# EAGLE design KaiShield (EAGLE 7.2.0)
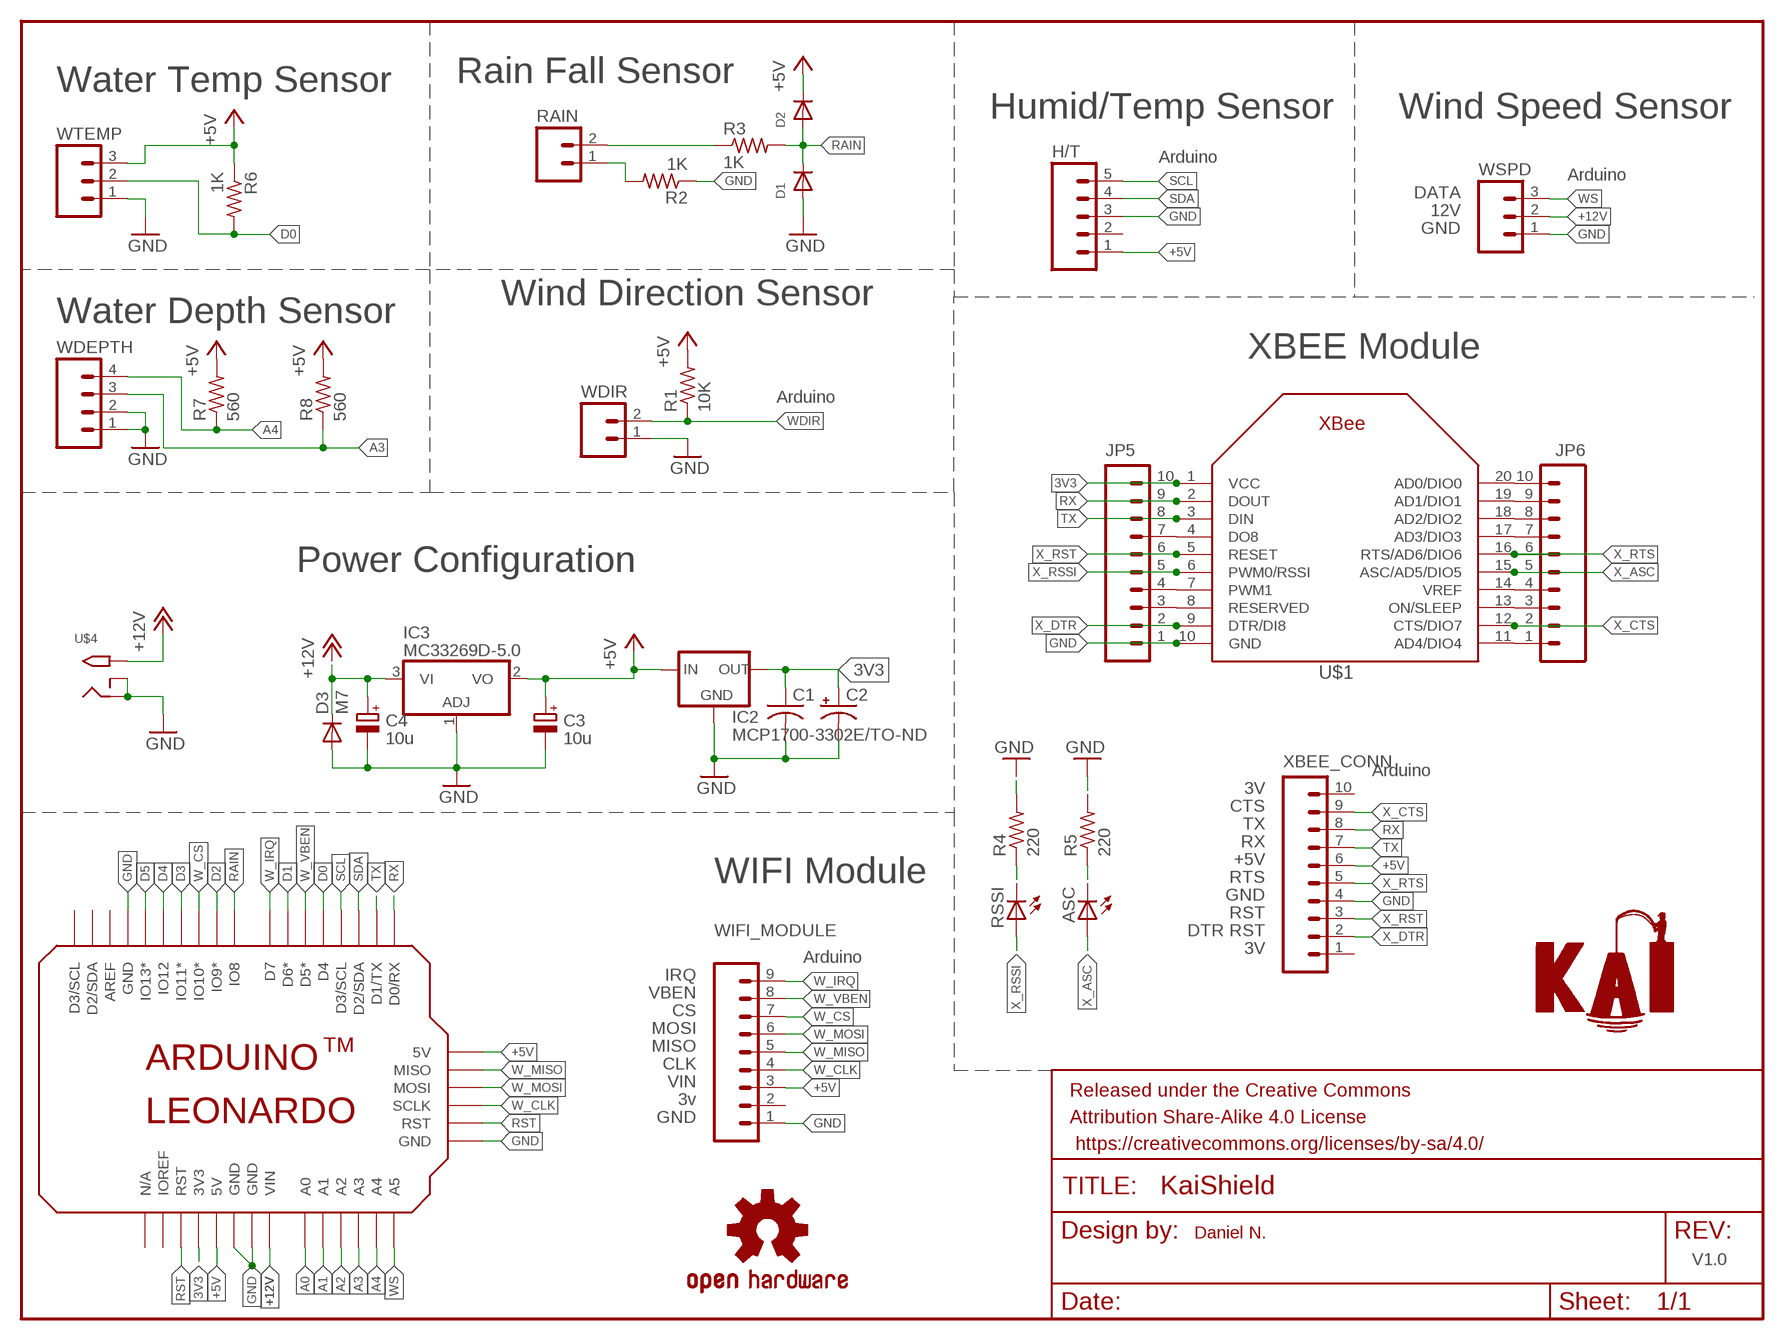
[diagram p0: schematic, sheet 1]

## Parts
ASC  LED3MM  [LED3MM]
C1  C-US025-025X050  [C025-025X050]
C2  CPOL-USE2.5-5  [E2,5-5]
C3  10u  CPOL-EUSMCB  [SMC_B]
C4  10u  CPOL-EUSMCB  [SMC_B]
D1  DIODEDO-1N4148  [DO-1N4148]
D2  DIODEDO-1N4148  [DO-1N4148]
D3  M7  DIODE-SMB  [SMB]
FRAME1  FRAME-LETTERNO_PACKAGE  [DUMMY]
H/T  M05PTH  [1X05]
IC2  MCP1700-3302E/TO-ND  MCP1700TRI  [TO92]
IC3  MC33269D-5.0  [DPACK]
JP5  M10SILK_FEMALE_PTH  [1X10]
JP6  M10SILK_FEMALE_PTH  [1X10]
LOGO1  OSHW-LOGOM  [OSHW-LOGO-M]
R1  10K  R-US_0207/10  [0207/10]
R2  1K  R-US_0207/10  [0207/10]
R3  1K  R-US_0207/10  [0207/10]
R4  220  R-US_0207/10  [0207/10]
R5  220  R-US_0207/10  [0207/10]
R6  1K  R-US_0207/10  [0207/10]
R7  560  R-US_0207/10  [0207/10]
R8  560  R-US_0207/10  [0207/10]
RAIN  M02PTH  [1X02]
RSSI  LED3MM  [LED3MM]
U$1  XBEE  [XBEE]
U$2  LEONARDO  [LEONARDO]
U$3  KAI_LOGO  [KAI_LOGO]
U$4  2.1MMJACKTHM  [PJ-102A]
WDEPTH  M04PTH  [1X04]
WDIR  M02PTH  [1X02]
WIFI_MODULE  M09  [1X09]
WSPD  M03PTH  [1X03]
WTEMP  M03PTH  [1X03]
XBEE_CONN  M10SILK_FEMALE_PTH  [1X10]

## Nets
3V3: C1.1 C2.+ IC2.3(OUT) JP5.10 U$1.1(VCC) U$2.3V(3V3)
+5V [power]: C3.+ D2.C H/T.1 IC2.2(IN) IC3.2(VO) R1.2 R6.1 R7.2 R8.2 U$2.5V U$2.5V@1(5V) WIFI_MODULE.3 WTEMP.3 XBEE_CONN.6
+12V [VIN]: C4.+ D3.C IC3.3(VI) U$2.VIN U$4.TIP WSPD.2
A0: U$2.A0
A1: U$2.A1
A2: U$2.A2
A3: R8.1 U$2.A3 WDEPTH.3
A4: R7.1 U$2.A4 WDEPTH.4
D0: R6.2 U$2.D4 WTEMP.2
D1: U$2.D6(D6*)
D2: U$2.D9(IO9*)
D3: U$2.D11(IO11*)
D4: U$2.D12(IO12)
D5: U$2.D13(IO13*)
GND [GND]: C1.2 C2.- C3.- C4.- D1.A D3.A H/T.3 IC2.1(GND) IC3.1(ADJ) JP5.1 R2.1 R4.2 R5.2 U$1.10(GND) U$2.GND U$2.GND1(GND) U$2.GND2(GND) U$2.GND3(GND) U$4.RING U$4.RING_SW WDEPTH.1 WDEPTH.2 WDIR.1 WIFI_MODULE.1 WSPD.1 WTEMP.1 XBEE_CONN.4
N$1: R3.1 RAIN.2
N$2: JP6.4 U$1.14(VREF)
N$3: R2.2 RAIN.1
N$4: JP6.3 U$1.13(ON/SLEEP)
N$5: R4.1 RSSI.K(C)
N$6: ASC.K(C) R5.1
N$7: JP5.7 U$1.4(DO8)
N$8: JP5.4 U$1.7(PWM1)
N$9: JP5.3 U$1.8(RESERVED)
RAIN: D1.C D2.A R3.2 U$2.D8(IO8)
RST: U$2.RST U$2.RST.(RST)
RX: JP5.9 U$1.2(DOUT) U$2.D0(D0/RX) XBEE_CONN.8
SCL: H/T.5 U$2.D3SCL(D3/SCL)
SDA: H/T.4 U$2.D2SDA(D2/SDA)
TX: JP5.8 U$1.3(DIN) U$2.D1(D1/TX) XBEE_CONN.7
W_CLK: U$2.SCLK WIFI_MODULE.4
W_CS: U$2.D10(IO10*) WIFI_MODULE.7
W_IRQ: U$2.D7 WIFI_MODULE.9
W_MISO: U$2.MISO WIFI_MODULE.5
W_MOSI: U$2.MOSI WIFI_MODULE.6
W_VBEN: U$2.D5(D5*) WIFI_MODULE.8
WDIR: R1.1 WDIR.2
WS: U$2.A5 WSPD.3
X0: JP6.10 U$1.20(AD0/DIO0)
X1: JP6.9 U$1.19(AD1/DIO1)
X2: JP6.8 U$1.18(AD2/DIO2)
X3: JP6.7 U$1.17(AD3/DIO3)
X4: JP6.1 U$1.11(AD4/DIO4)
X_ASC: ASC.A JP6.5 U$1.15(ASC/AD5/DIO5)
X_CTS: JP6.2 U$1.12(CTS/DIO7) XBEE_CONN.9
X_DTR: JP5.2 U$1.9(DTR/DI8) XBEE_CONN.2
X_RSSI: JP5.5 RSSI.A U$1.6(PWM0/RSSI)
X_RST: JP5.6 U$1.5(RESET) XBEE_CONN.3
X_RTS: JP6.6 U$1.16(RTS/AD6/DIO6) XBEE_CONN.5
Unconnected: H/T.2 U$2.AREF U$2.D2SDA1(D2/SDA) U$2.D3SCL1(D3/SCL) U$2.I/OREF(IOREF) U$2.NA(N/A) WIFI_MODULE.2 XBEE_CONN.1 XBEE_CONN.10

## Notes on the sheet
- Water Temp Sensor | Rain Fall Sensor
- Humid/Temp Sensor | Wind Speed Sensor
- Arduino
- Arduino
- DATA
- 12V
- GND
- Wind Direction Sensor
- Water Depth Sensor
- XBEE Module
- Arduino
- Power Configuration
- Arduino
- 3V
- CTS
- TX
- RX
- +5V
- WIFI Module | RTS
- GND
- RST
- DTR RST
- 3V
- Arduino
- IRQ
- VBEN
- CS
- MOSI
- MISO
- CLK
- VIN
- 3v
- GND
- Daniel N.
- V1.0

## Library data of the parts
ASC RSSI = adafruit:LED: LED OSRAM: - CHIPLED LG R971, LG N971, LY N971, LG Q971, LY Q971, LO R971, LY R971 LH N974, LH R974 LS Q976, LO Q976, LY Q976 LO Q996 - Hyper CHIPLED LW Q18S LB Q993, LB Q99A, LB R99A - SideLED LS A670, LO A670, LY A670, LG A670, LP A670 LB A673, LV A673, LT A673, LW A673 LH A674 LY A675 LS A676, LA A676, LO A676, LY A676, LW A676 LS A679, LY A679, LG A679 - Hyper Micro SIDELED® LS Y876, LA Y876, LO Y876, LY Y876 LT Y87S - SmartLED LW L88C, LW L88S LB L89C, LB L89S, LG L890 LS L89K, LO L89K, LY L89K LS L896, LA L896, LO L896, LY L896 - TOPLED LS T670, LO T670, LY T670, LG T670, LP T670 LSG T670, LSP T670, LSY T670, LOP T670, LYG T670 LG T671, LOG T671, LSG T671 LB T673, LV T673, LT T673, LW T673 LH T674 LS T676, LA T676, LO T676, LY T676, LB T676, LH T676, LSB T676, LW T676 LB T67C, LV T67C, LT T67C, LS T67K, LO T67K, LY T67K, LW E67C LS E67B, LA E67B, LO E67B, LY E67B, LB E67C, LV E67C, LT E67C LW T67C LS T679, LY T679, LG T679 LS T770, LO T770, LY T770, LG T770, LP T770 LB T773, LV T773, LT T773, LW T773 LH T774 LS E675, LA E675, LY E675, LS T675 LS T776, LA T776, LO T776, LY T776, LB T776 LHGB T686 LT T68C, LB T68C - Hyper Mini TOPLED® LB M676 - Mini TOPLED Santana® LG M470 LS M47K, LO M47K, LY M47K Source: http://www.osram.convergy.de/
C1 = rcl:C-US: CAPACITOR, American symbol
C2 = rcl:CPOL-US: POLARIZED CAPACITOR, American symbol
C3 C4 = rcl:CPOL-EU: POLARIZED CAPACITOR, European symbol
D1 D2 = adafruit:DIODE: Diode SMADIODE - SMA Surface Mount Package 20V 1A Schottky Diode Digikey: 641-1014-6-ND DO-1N4148 - Through Hole Small Current Diode SOD-123 20V 1 A (.5mV Vf) Schottky Diode - Digikey: MBRX120TPMSCT-ND SOD-323 10V 570mA (.38mV Vf, 3ns) Schottky Diode - Digikey: ZLLS410CT-ND SOD-523 30V 30mA Schottky Diode (RB751S-40TE61) - Digikey: RB751S-40TE61CT-ND SOT23-R/W - SOT23 Package (R = Solder Paste/Reflow Ovens, W = Hand-Soldering) BAT54Film 40V 300mA - Digikey: 497-7162-1-ND
D3 = diode:DIODE-: DIODE
FRAME1 = SparkFun-Aesthetics:FRAME-LETTER: Schematic Frame Standard 8.5x11 US Letter frame; DESIGNER: Nobody; VERSION: v01
H/T = SparkFun-Connectors:M05: Header 5 Standard 5-pin 0.1" header. Use with straight break away headers (SKU : PRT-00116), right angle break away headers (PRT-00553), swiss pins (PRT-00743), machine pins (PRT-00117), and female headers (PRT-00115). Molex polarized connector foot print use with SKU : PRT-08230 with associated crimp pins and housings.
IC2 = adafruit:MCP1700: VOLTAGE REGULATOR
IC3 = linear:MC33269?*: Adjustable Output Low Dropout Voltage Regulator 800 mA Source: http://www.onsemi.com/pub/Collateral/MC33269-D.PDF
JP5 JP6 XBEE_CONN = SparkFun-Connectors:M10: Header 10 Standard 10-pin 0.1" header. Use with straight break away headers (SKU : PRT-00116), right angle break away headers (PRT-00553), swiss pins (PRT-00743), machine pins (PRT-00117), and female headers (PRT-00115).; PROD_ID: CONN-11563
LOGO1 = SparkFun-Aesthetics:OSHW-LOGO: Open Source Hardware Logo This logo indicates the piece of hardware it is found on incorporates a OSHW license and/or adheres to the definition of open source hardware found here: http://freedomdefined.org/OSHW
R1-R8 = rcl:R-US_: RESISTOR, American symbol
RAIN WDIR = SparkFun-Connectors:M02: Standard 2-pin 0.1" header. Use with - straight break away headers ( PRT-00116) - right angle break away headers (PRT-00553) - swiss pins (PRT-00743) - machine pins (PRT-00117) - female headers (PRT-00115) Molex polarized connector foot print use with: PRT-08233 with associated crimp pins and housings. 2.54_SCREWTERM for use with PRT-10571. 3.5mm Screw Terminal footprints for PRT-08084 5mm Screw Terminal footprints for use with PRT-08432
U$1 = adafruit:XBEE
U$2 = Kai:LEONARDO: Leonardo Shield Leonardo Shield package. Contains all the pins for the Leonardo. The outline is on the DIMENSION layer. Originally Modified from Adafruit Arduino Package.
U$3 = Kai:KAI_LOGO
U$4 = adafruit:2.1MMJACK: 2.1mm x 5.5mm THM DC jack with internal switch. Digikey part #PJ-102A, 4UCON part #05537 2.1mm x 5.5mm SMT DC jack with internal switch. Digikey part #PJ-002A-SMT, 4UCON part #03267 By microbuilder.eu & adafruit.com
WDEPTH = SparkFun-Connectors:M04: Header 4 Standard 4-pin 0.1" header. Use with straight break away headers (SKU : PRT-00116), right angle break away headers (PRT-00553), swiss pins (PRT-00743), machine pins (PRT-00117), and female headers (PRT-00115). Molex polarized connector foot print use with SKU : PRT-08231 with associated crimp pins and housings. 1MM SMD Version SKU: PRT-10208
WIFI_MODULE = SparkFun-Connectors:M09: Header 9 Standard 9-pin 0.1" header. Use with straight break away headers (SKU : PRT-00116), right angle break away headers (PRT-00553), swiss pins (PRT-00743), machine pins (PRT-00117), and female headers (PRT-00115).
WSPD WTEMP = SparkFun-Connectors:M03: Header 3 Standard 3-pin 0.1" header. Use with straight break away headers (SKU : PRT-00116), right angle break away headers (PRT-00553), swiss pins (PRT-00743), machine pins (PRT-00117), and female headers (PRT-00115). Molex polarized connector foot print use with SKU : PRT-08232 with associated crimp pins and housings.

## Net classes
0 default: width 0.305 mm, drill 0.61 mm, clearance 0.254 mm
1 GND: width 0.305 mm, drill 0.61 mm, clearance 0.254 mm
2 power: width 0.61 mm, drill 0.61 mm, clearance 0.254 mm
3 VIN: width 0.61 mm, drill 0.61 mm, clearance 0.254 mm

## Board
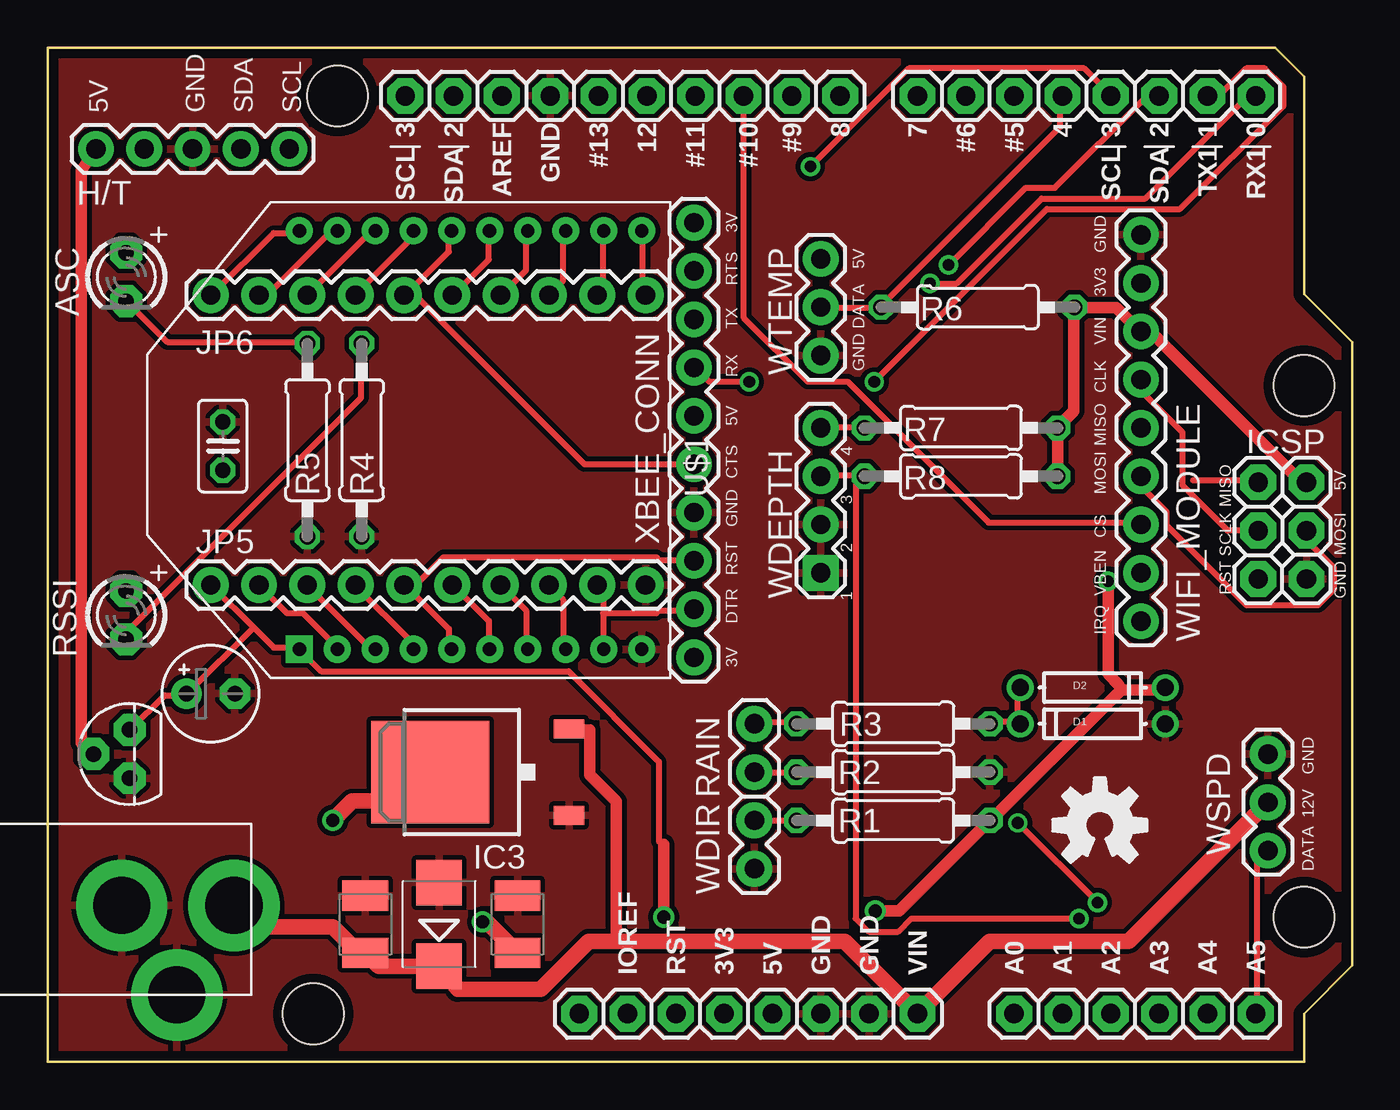
[diagram p1: board, top side]
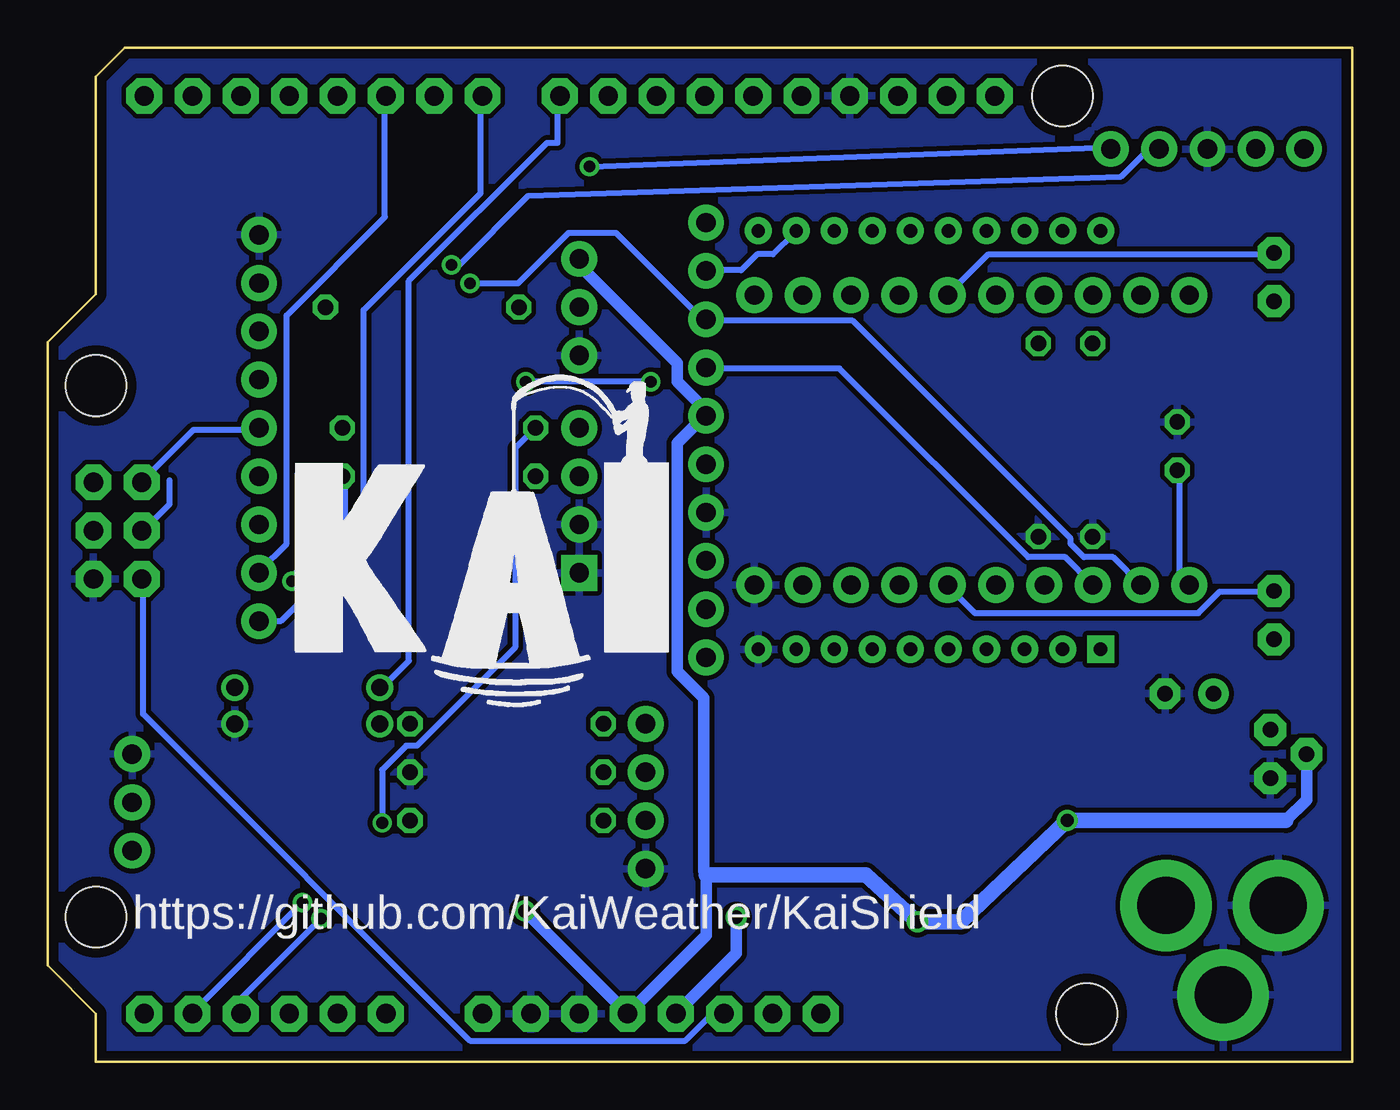
[diagram p2: board, bottom side, seen from below]

Size 68.58 x 53.34 mm. Coordinates in mm from the lower left corner, seen from the top.
Copper layers (1*16): Top 0.035mm / dielectric 1.5mm / Bottom 0.035mm
Design rules "default *": minimum track width 10mil, minimum drill 24mil, track to track 8mil, track to pad 8mil, pad to pad 8mil, via to via 8mil, smd to smd 8mil, copper to edge 20mil, drill to drill 8mil, minimum pad ring 10mil, minimum via ring 8mil, stop-mask expansion 4mil, vias tented up to drill 0mil, thermal gap 10mil

### Footprints (pad centres in the part's own frame; a part is rotated, then mirrored left to right if it is on the bottom)
LED3MM = drill 0.813 pad 1.676 octagon: A -1.27,0; K 1.27,0
C025-025X050 = drill 0.813 octagon: 1 -1.27,0; 2 1.27,0
E2,5-5 = drill 0.813 pad 1.6: + -1.27,0 | drill 0.813 pad 1.6 octagon: - 1.27,0
SMC_B = smd 1.6 x 2.4: + -1.5,0; - 1.5,0
DO-1N4148 = drill 0.9: A -3.81,0; C 3.81,0
SMB = smd 2.4 x 2.4: A 2.2,0; C -2.2,0
1X05 = drill 1.016 pad 1.88: 1 0,0; 2 2.54,0; 3 5.08,0; 4 7.62,0; 5 10.16,0
TO92 = drill 0.813 pad 1.676 octagon: 1 -1.27,0; 2 0,1.905; 3 1.27,0
DPACK = smd 1 x 1.6: 1 -2.28,-4.8; 3 2.28,-4.8 | smd 5.4 x 6.2: 2 0,2.5
1X10 = drill 1.016 pad 1.88: 1 0,0; 2 2.54,0; 3 5.08,0; 4 7.62,0; 5 10.16,0; 6 12.7,0; 7 15.24,0; 8 17.78,0; 9 20.32,0; 10 22.86,0
0207/10 = drill 0.813 octagon: 1 -5.08,0; 2 5.08,0
1X02 = drill 1.016 pad 1.88: 1 0,0; 2 2.54,0
XBEE = drill 0.7 pad 1.422 square: 1 -11,5.5 | drill 0.7 pad 1.422: 2 -11,3.5; 3 -11,1.5; 4 -11,-0.5; 5 -11,-2.5; 6 -11,-4.5; 7 -11,-6.5; 8 -11,-8.5; 9 -11,-10.5; 10 -11,-12.5; 11 11,-12.5; 12 11,-10.5; 13 11,-8.5; 14 11,-6.5; 15 11,-4.5; 16 11,-2.5; 17 11,-0.5; 18 11,1.5; 19 11,3.5; 20 11,5.5
LEONARDO = drill 1.016 pad 1.88 octagon: 3V 35.56,2.54; 5V 38.1,2.54; 5V@1 66.167,30.48; A0 50.8,2.54; A1 53.34,2.54; A2 55.88,2.54; A3 58.42,2.54; A4 60.96,2.54; A5 63.5,2.54; AREF 23.876,50.8; D0 63.5,50.8; D1 60.96,50.8; D2SDA 58.42,50.8; D2SDA1 21.336,50.8; D3SCL 55.88,50.8; D3SCL1 18.796,50.8; D4 53.34,50.8; D5 50.8,50.8; D6 48.26,50.8; D7 45.72,50.8; D8 41.656,50.8; D9 39.116,50.8; D10 36.576,50.8; D11 34.036,50.8; D12 31.496,50.8; D13 28.956,50.8; GND 26.416,50.8; GND1 43.18,2.54; GND2 40.64,2.54; GND3 66.167,25.4; I/OREF 30.48,2.54; MISO 63.627,30.48; MOSI 66.167,27.94; NA 27.94,2.54; RST 33.02,2.54; RST. 63.627,25.4; SCLK 63.627,27.94; VIN 45.72,2.54 | hole 3.2: 15.24,50.8; 66.04,35.56; 13.97,2.54; 66.04,7.62
PJ-102A = drill 3 pad 4.8: RING 0.1,-3.39; RING_SW -4.6,-6.29; TIP 0.1,-9.29
1X04 = drill 1.016 pad 1.88 square: 1 0,0 | drill 1.016 pad 1.88: 2 2.54,0; 3 5.08,0; 4 7.62,0
1X09 = drill 1.016 pad 1.88: 1 0,0; 2 2.54,0; 3 5.08,0; 4 7.62,0; 5 10.16,0; 6 12.7,0; 7 15.24,0; 8 17.78,0; 9 20.32,0
1X03 = drill 1.016 pad 1.88: 1 0,0; 2 2.54,0; 3 5.08,0

### Placement (x,y rotation side)
ASC  4.13,41.27 270 top
C1  9.21,32.38 90 top
C2  8.57,19.37 0 top
C3  24.7,7.24 90 top
C4  16.7,7.24 90 top
D1  54.93,17.78 180 top
D2  54.93,19.68 0 top
D3  20.57,7.24 90 top
FRAME1  0,0.32 0 top
H/T  2.54,48.01 0 top
IC2  4.32,16.19 90 top
IC3  22.61,15.24 90 top
JP5  31.43,25.08 180 top
JP6  31.43,40.32 180 top
LOGO1  55.31,12.45 0 top
R1  44.45,12.7 0 top
R2  44.45,15.24 180 top
R3  44.45,17.78 0 top
R4  16.51,32.7 270 top
R5  13.65,32.7 270 top
R6  48.9,39.69 180 top
R7  48.01,33.34 0 top
R8  48.01,30.8 0 top
RAIN  37.15,15.24 90 top
RSSI  4.13,23.5 270 top
U$1  18.73,32.7 90 top
U$2  0,0 0 top
U$3  58.74,18.35 0 bottom
U$4  0.51,8.13 90 top
WDEPTH  40.64,25.72 90 top
WDIR  37.15,10.16 90 top
WIFI_MODULE  57.47,43.5 270 top
WSPD  64.14,16.19 270 top
WTEMP  40.64,37.15 90 top
XBEE_CONN  33.97,21.27 90 top

### Tracks (layer width: path | path; a pad name or v marks a point on that pad's centre or on a via)
3V3  (via drill 0.7)
  Top 0.305: IC2.3 4.33,17.46 6.15,19.28 7.26,19.28 C2.+ 7.4,19.42 10.83,22.84 | 10.83,22.84 8.66,25.01 JP5.10 | 10.83,22.84 11.87,21.79 13.13,21.79 U$1.1 13.27,21.65 14.39,20.54 27.38,20.54 32.13,15.79 32.13,11.6 32.38,11.43
  Top 0.61: 32.38,11.43 v32.38,7.62
  Bottom 0.305: C1.1 9.08,31.01 9.08,25.57 8.66,25.15 JP5.10
  Bottom 0.61: v32.38,7.62 32.38,5.71 U$2.3V
+5V  (via drill 0.61, 0.7)
  Top 0.61: IC2.2 2.35,16.19 1.78,16.76 1.78,46.86 H/T.1 | v43.5,7.94 44.77,7.94 R1.2 49.73,12.85 56.44,19.56 | 65.66,30.59 66.08,30.59 U$2.5V@1 65.52,30.87 58.12,38.28 57.7,38.28 WIFI_MODULE.3 57.42,38.42 56.16,39.67 54.06,39.67 R6.1 53.92,39.4 53.92,34.23 53.23,33.53 R7.2 R8.2 | 56.44,19.56 58.67,19.56 D2.C | v55.74,25.29 55.74,20.4 56.3,19.84 56.44,19.56
  Top 0.813: v22.86,7.37 23.07,7.37 C3.+ | v14.99,12.7 16,13.72 19.6,13.72 IC3.2
  Bottom 0.61: v43.5,7.94 U$2.5V 33.97,6.67 33.97,9.84 34.09,10.06 34.09,19.14 35.48,20.54 35.48,32.55 34.23,33.81 XBEE_CONN.6 | IC2.2 2.41,13.78 3.49,12.7 | 34.09,34.51 34.09,34.09 XBEE_CONN.6 | v55.74,25.29 53.09,27.94 R8.2 | WTEMP.3 40.51,42.19 40.51,41.77 35.48,36.74 35.48,35.76 34.37,34.65 XBEE_CONN.6
  Bottom 0.813: 3.49,12.7 v14.99,12.7 20.57,7.37 v22.86,7.37 25.59,9.84 33.97,9.84
+12V
  Top 0.61: 29.9,6.35 29.9,13.69 28.5,15.09 28.5,17.46 IC3.3
  Top 0.813: WSPD.2 56.83,6.35 49.53,6.35 U$2.VIN 41.91,6.35 29.9,6.35 28.45,6.35 25.91,3.81 21.55,3.81 D3.C 17.4,5.04 C4.+ 16.36,5.74 14.99,7.11 10.91,7.11 U$4.TIP
A3  (via drill 0.61)
  Top 0.305: WDEPTH.3 40.65,30.87 42.89,30.87 R8.1 42.47,30.73 42.47,7.54 43.17,6.84 44.7,6.84 45.4,7.54 v54.2,7.54
  Bottom 0.305: v54.2,7.54 58.4,3.35 58.4,2.65 U$2.A3
A4  (via drill 0.61)
  Top 0.305: R7.1 42.89,33.39 40.65,33.39 WDEPTH.4 | v50.99,12.57 v55.18,8.38
  Bottom 0.305: v55.18,8.38 60.91,2.65 U$2.A4 | v50.99,12.57 50.99,15.37 49.73,16.62 49.17,16.62 44.01,21.79 44.01,32.27 43.03,33.25 R7.1
D0
  Top 0.305: U$2.D4 53.23,50.71 53.23,49.17 43.87,39.81 R6.2 43.73,39.67 40.65,39.67 WTEMP.2
GND
  pour Bottom: -0.64,0 66.04,-0.32 66.04,2.54 68.58,5.08 68.58,38.1 66.04,40.64 66.04,52.07 64.14,53.34 -0.64,53.34
  pour Top: -0.95,-0.64 66.04,-0.64 66.04,2.54 68.58,5.08 68.58,38.1 66.04,40.64 66.04,52.07 64.77,53.34 -0.95,53.34
N$1
  Top 0.305: R3.1 39.26,17.88 37.16,17.88 RAIN.2
N$2
  Top 0.305: U$1.14 25.15,43.59 25.15,41.63 23.89,40.37 JP6.4
N$3
  Top 0.305: R2.2 39.26,15.23 37.16,15.23 RAIN.1
N$4
  Top 0.305: JP6.3 27.1,41.07 27.1,43.59 U$1.13
N$5
  Top 0.305: R4.1 16.48,37.72 16.48,34.92 4.19,22.63 4.19,22.35 RSSI.K
N$6
  Top 0.305: R5.1 13.55,37.86 6.29,37.86 4.19,39.95 ASC.K
N$7
  Top 0.305: U$1.4 19.14,21.79 19.14,22.07 16.2,25.01 JP5.7
N$8
  Top 0.305: JP5.4 25.15,23.75 25.15,21.79 U$1.7
N$9
  Top 0.305: U$1.8 27.1,21.79 27.1,24.31 26.4,25.01 JP5.3
RAIN
  Top 0.305: R3.2 49.59,17.88 50.99,17.88 D1.C 50.99,18.02 50.99,19.56 D2.A
  Bottom 0.305: U$2.D8 41.77,50.71 41.77,48.34 42.33,48.34 49.59,41.07 49.59,21.09 50.99,19.7 D2.A
RST
  Bottom 0.305: U$2.RST 33.11,2.52 33.67,2.52 35.06,1.12 46.38,1.12 63.56,18.3 63.56,25.29 U$2.RST.
RX  (via drill 0.61)
  Top 0.305: U$1.2 15.23,21.79 13.41,23.61 12.57,23.61 11.18,25.01 JP5.9 | 62.87,50.71 63.42,50.71 U$2.D0 62.87,50.57 57.7,45.4 52.25,45.4 47.78,40.93 v46.38,40.93
  Bottom 0.305: JP5.9 12.57,26.54 14.11,26.54 14.81,27.24 14.81,27.52 26.26,38.98 33.95,38.98 XBEE_CONN.8 | 34.09,39.12 XBEE_CONN.8 | v46.38,40.93 43.87,40.93 41.21,43.59 38.7,43.59 34.23,39.12 XBEE_CONN.8
SCL  (via drill 0.61)
  Top 0.305: v40.09,47.08 45.26,52.25 54.48,52.25 55.88,50.85 U$2.D3SCL
  Bottom 0.305: v40.09,47.08 12.71,48.09 H/T.5
SDA  (via drill 0.61)
  Top 0.305: 58.4,50.71 U$2.D2SDA 58.26,50.71 57.7,50.71 52.95,45.96 51.41,45.96 v47.36,41.91
  Bottom 0.305: H/T.4 10.2,47.95 10.76,47.95 12.15,46.56 43.31,45.54 46.94,41.91 v47.36,41.91
TX  (via drill 0.61)
  Top 0.305: U$1.3 17.18,21.79 16.9,21.79 13.69,25.01 JP5.8 | 60.35,50.71 60.91,50.71 U$2.D1 61.05,50.85 61.61,50.85 63.01,52.25 63.98,52.25 64.96,51.27 64.96,50.29 59.51,44.84 52.53,44.84 v43.45,35.76 | v36.88,35.76 34.78,35.76 34.09,36.46 XBEE_CONN.7
  Bottom 0.305: XBEE_CONN.7 33.95,36.46 26.96,36.46 17.04,26.54 15.09,26.54 13.69,25.15 JP5.8 | v36.88,35.76 v43.45,35.76
W_CLK
  Top 0.305: U$2.SCLK 62.03,27.94 59.65,30.32 59.65,33.11 57.56,35.2 57.56,35.76 WIFI_MODULE.4
  Bottom 0.305: 62.17,30.59 62.17,29.34 63.56,27.94 U$2.SCLK
W_CS
  Top 0.305: U$2.D10 36.6,50.71 36.6,39.12 39.95,35.76 42.05,35.76 49.45,28.36 57.42,28.36 WIFI_MODULE.7
W_IRQ
  Bottom 0.305: 45.82,50.71 U$2.D7 45.82,50.57 45.82,45.68 51.97,39.53 51.97,27.52 56.3,23.19 57.42,23.19 WIFI_MODULE.9
W_MISO
  Top 0.305: 60.21,30.59 63.56,30.59 U$2.MISO
  Bottom 0.305: WIFI_MODULE.5 57.56,33.25 60.91,33.25 63.56,30.59 U$2.MISO
W_MOSI
  Top 0.305: U$2.MOSI 66.22,27.94 66.22,27.38 67.61,25.98 67.61,24.87 66.78,24.03 63.01,24.03 58.81,28.22 58.81,28.92 57.56,30.18 57.56,30.73 WIFI_MODULE.6
W_VBEN
  Bottom 0.305: 50.85,50.71 U$2.D5 50.85,50.57 50.85,44.42 56.02,39.26 56.02,27.24 57.42,25.84 WIFI_MODULE.8
WDIR
  Top 0.305: R1.1 39.26,12.71 37.16,12.71 WDIR.2
WS
  Top 0.305: U$2.A5 63.56,2.65 63.56,10.48 64.12,11.04 WSPD.3
X0
  Top 0.305: U$1.20 13.13,43.59 11.87,43.59 8.66,40.37 JP6.10
X1
  Top 0.305: U$1.19 15.23,43.59 14.81,43.59 11.6,40.37 11.18,40.37 JP6.9
X2
  Top 0.305: U$1.18 17.18,43.59 16.9,43.59 13.69,40.37 JP6.8
X3
  Top 0.305: U$1.17 19.14,43.59 19.14,43.31 16.2,40.37 JP6.7
X4
  Top 0.305: U$1.11 31.29,43.59 31.29,40.51 31.43,40.37 JP6.1
X_ASC
  Top 0.305: U$1.15 23.19,43.59 23.19,42.19 21.37,40.37 JP6.5
  Bottom 0.305: ASC.A 4.19,42.47 19.14,42.47 21.23,40.37 JP6.5
X_CTS
  Top 0.305: U$1.12 29.2,43.59 29.2,40.65 28.92,40.37 JP6.2
  Bottom 0.305: XBEE_CONN.9 33.95,41.63 32.13,41.63 31.29,42.47 30.45,42.47 29.34,43.59 U$1.12
X_DTR
  Top 0.305: 29.2,23.61 29.2,24.73 28.92,25.01 JP5.2 | 29.2,23.61 29.2,21.79 U$1.9 | 29.2,23.61 31.99,23.61 32.13,23.75 33.95,23.75 XBEE_CONN.2
X_RSSI
  Top 0.305: U$1.6 23.19,21.79 23.19,23.19 21.37,25.01 JP5.5
  Bottom 0.305: RSSI.A 4.19,24.73 6.99,24.73 8.1,23.61 19.84,23.61 21.23,25.01 JP5.5
X_RST
  Top 0.305: U$1.5 21.09,21.79 21.09,22.77 18.86,25.01 JP5.6 19.14,24.87 20.82,26.54 31.99,26.54 32.13,26.4 33.95,26.4 XBEE_CONN.3
X_RTS
  Top 0.305: U$1.16 21.09,43.59 21.09,42.61 18.86,40.37 JP6.6 19.14,40.51 28.22,31.43 XBEE_CONN.5

### Text on the board
tPlace: 5V | GND | SDA | SCL | 3V | GND | 5V | RTS | 3V3 | TX | DATA | VIN | RX | GND | CLK | 5V | 4 | MISO | CTS | MOSI | 3 | GND | CS | 2 | RST | VBEN | 1 | DTR | IRQ | 3V | GND | 12V | DATA
bPlace: https://github.com/KaiWeather/KaiShield